# EAGLE design HallBoards (EAGLE 7.2.0)
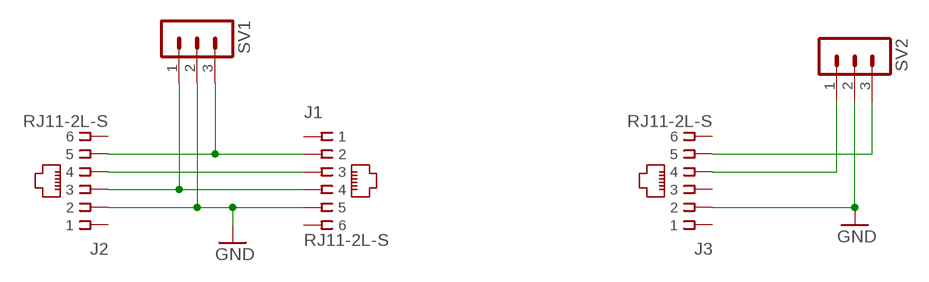
[diagram p0: schematic, sheet 1]

## Parts
J1  RJ11-2L-S  [RJ11-NO_SHIELD]
J2  RJ11-2L-S  [RJ11-NO_SHIELD]
J3  RJ11-2L-S  [RJ11-NO_SHIELD]
SV1  MA03-1  [MA03-1]
SV2  MA03-1  [MA03-1]

## Nets
GND: J1.5 J2.2 J3.2 SV1.2 SV2.2
N$2: J1.4 J2.3 SV1.1
N$3: J1.3 J2.4
N$4: J1.2 J2.5 SV1.3
N$6: J3.5 SV2.3
N$7: J3.4 SV2.1
Unconnected: J1.1 J1.6 J2.1 J2.6 J3.1 J3.3 J3.6

## Library data of the parts
J1-J3 = KevinsLib:RJ11: CORCOM Modular RJ Jacks No Shield Source: www.tycoelectronics.com .. ENG_DS_1654001_1099_RJ_L_0507.pdf; MPN: RJ11-2L-S; OC_FARNELL: unknown; OC_NEWARK: 73K3294
SV1 SV2 = con-lstb:MA03-1: PIN HEADER; OC_FARNELL: unknown; OC_NEWARK: unknown

## Board
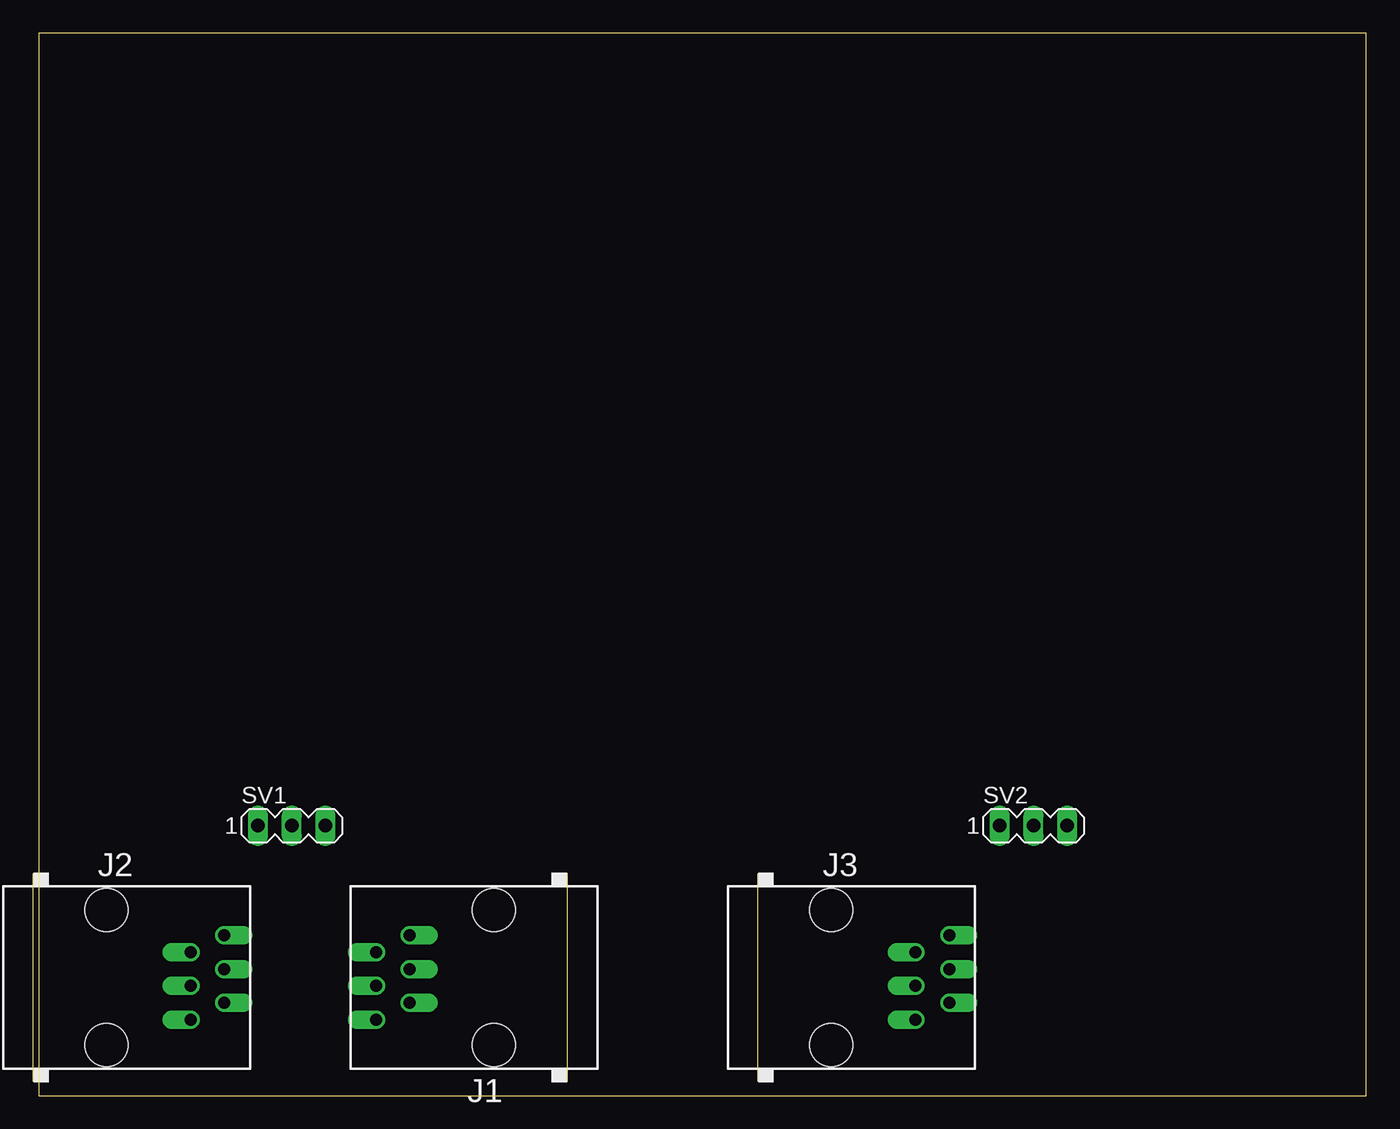
[diagram p1: board, top side]
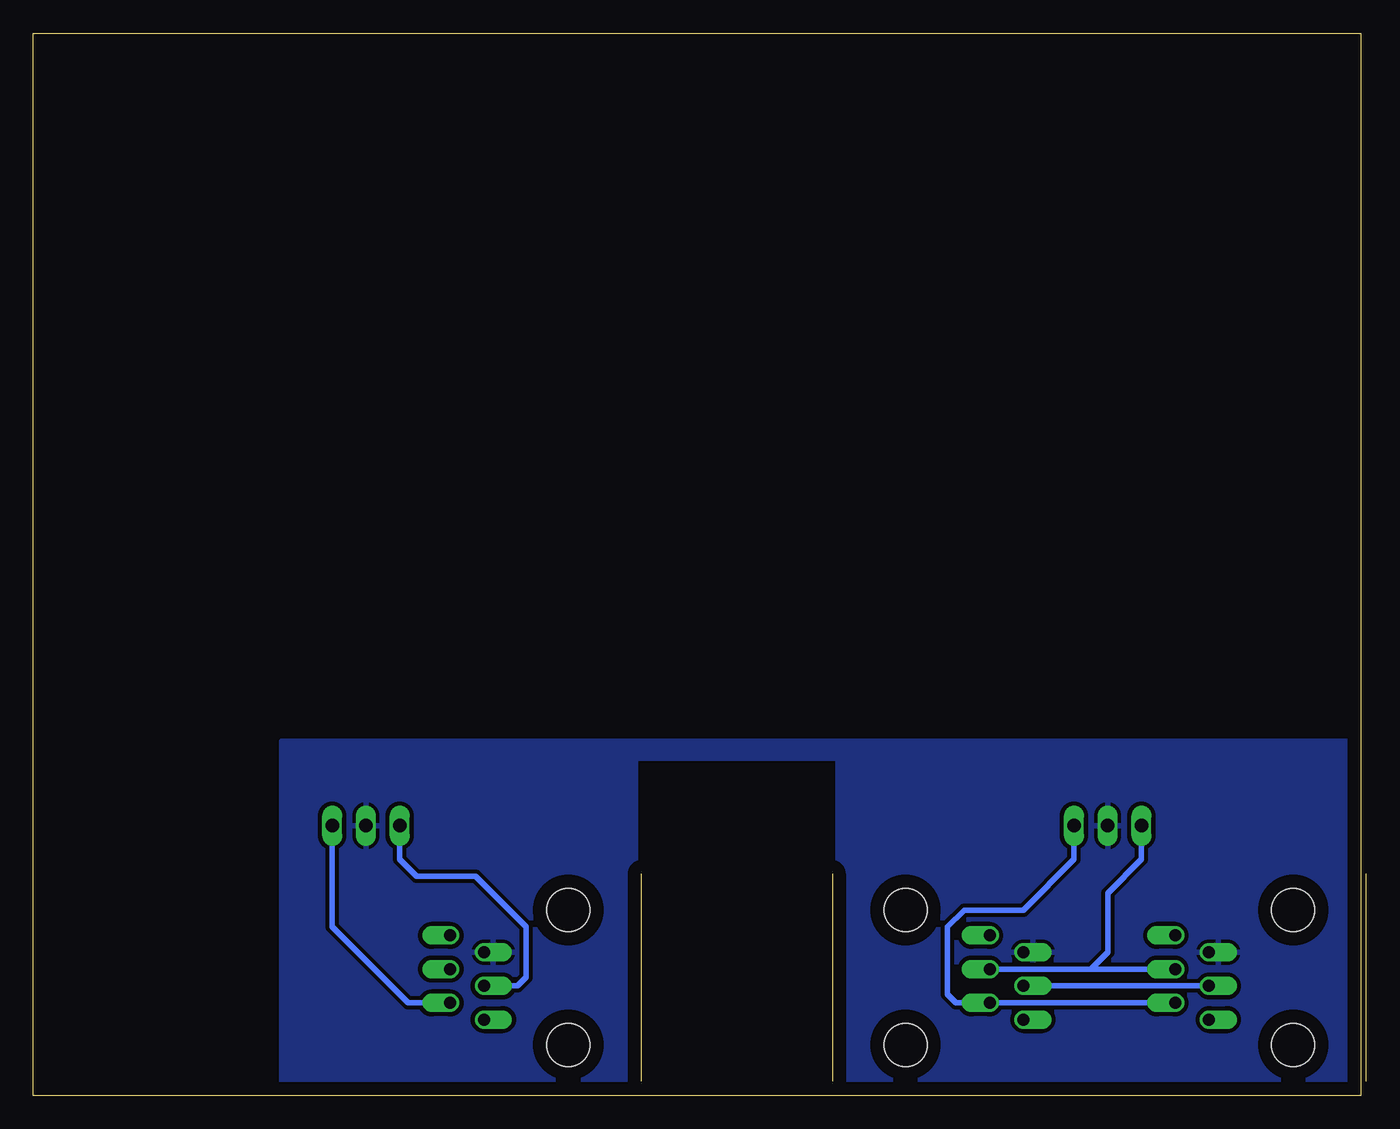
[diagram p2: board, bottom side, seen from below]

Size 100 x 80 mm. Coordinates in mm from the lower left corner, seen from the top.
Outline: 0,0 100,0 100,80 0,80 0,0
Copper layers (1*16): Top 0.035mm / dielectric 1.5mm / Bottom 0.035mm
Design rules "default": minimum track width 10mil, minimum drill 24mil, track to track 8mil, track to pad 8mil, pad to pad 8mil, via to via 8mil, smd to smd 8mil, copper to edge 40mil, drill to drill 8mil, minimum pad ring 10mil, minimum via ring 8mil, stop-mask expansion 4mil, vias tented up to drill 0mil, thermal gap 10mil

### Footprints (pad centres in the part's own frame; a part is rotated, then mirrored left to right if it is on the bottom)
RJ11-NO_SHIELD = drill 0.9 pad 1.4 offset: 1 -3.175,8.89; 2 -1.905,6.35; 3 -0.635,8.89; 4 0.635,6.35; 5 1.905,8.89; 6 3.175,6.35 | hole 3.251: -5.08,0; 5.08,0
MA03-1 = drill 1.016 long: 1 -2.54,0; 2 0,0; 3 2.54,0

### Placement (x,y rotation side)
J1  34.29,8.89 90 top
J2  5.08,8.89 270 top
J3  59.69,8.89 270 top
SV1  19.05,20.32 0 top
SV2  74.93,20.32 0 top

### Tracks (layer width: path | path; a pad name or v marks a point on that pad's centre or on a via)
GND
  pour Bottom (isolate 0.305): 0,0 0,26.67 81.28,26.67 81.28,0 54.61,0 54.61,25.4 39.37,25.4 39.37,0
N$2
  Bottom 0.406: J2.3 20.32,9.53 | 20.32,9.53 J1.4 | SV1.1 16.51,17.78 19.05,15.24 19.05,10.79 20.32,9.53
N$3
  Bottom 0.406: J2.4 J1.3
N$4
  Bottom 0.406: J2.5 J1.2 30.48,6.99 31.11,7.62 31.11,12.7 29.84,13.97 25.4,13.97 21.59,17.78 SV1.3
N$6
  Bottom 0.406: J3.5 71.75,6.99 77.47,12.7 SV2.3
N$7
  Bottom 0.406: SV2.1 72.39,17.78 71.12,16.51 66.67,16.51 62.87,12.7 62.87,8.89 63.5,8.26 J3.4